# Altium project Drv8701e.PrjPcb
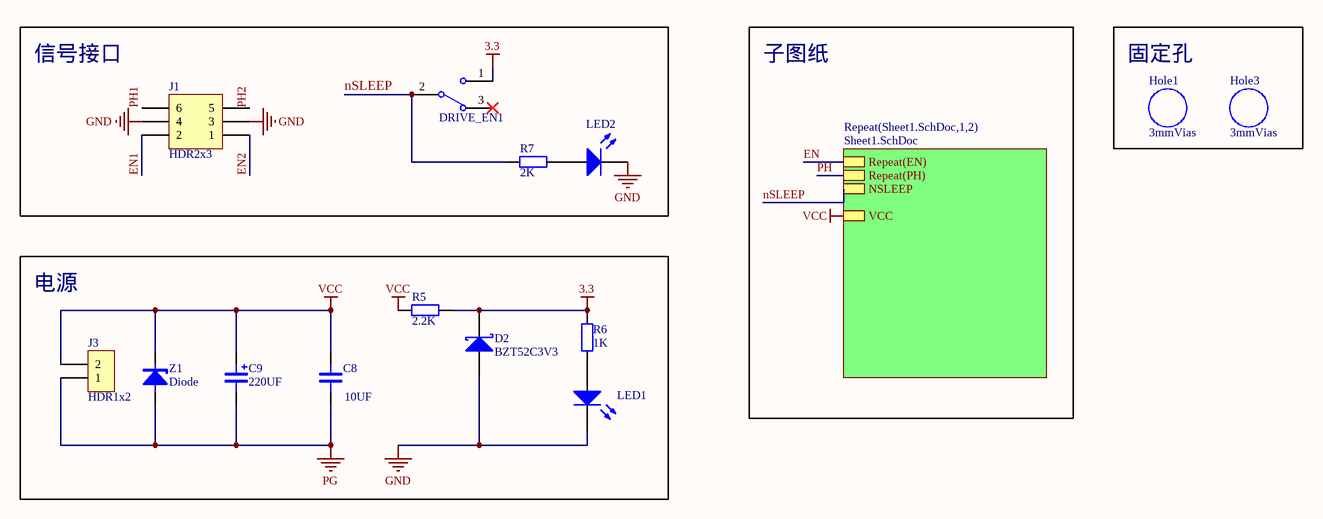
[diagram p0: Sheet2.SchDoc]
2 sheets, 46 parts. Net scope: hierarchical (ports join the sheet entries above them; power ports are global).
Board file: PCB1.PcbDoc
Sheets:
  Sheet2.SchDoc
    Sheet1.SchDoc1 = Sheet1.SchDoc
    Sheet1.SchDoc2 = Sheet1.SchDoc

## Sheet Sheet2.SchDoc
size A4

### Parts
C8  10UF  [0603]
C9  220UF  [DIP-EC3.5X8X11.5]
D2  BZT52C3V3  [SOD-123]
DRIVE_EN1  SW-SPDT  [ss12d10]  (value not drawn)
Hole1  3mmVias  [3mm]
Hole3  3mmVias  [3mm]
J1  HDR2x3  [pin_2*3]
J3  HDR1x2  [TX30_接口]
LED1  LED0  [0603-led]  (value not drawn)
LED2  LED0  [0603-led]  (value not drawn)
R5  2.2K  [0603]
R6  1K  [0603]
R7  2K  [0603]
Z1  Diode  [SMA]

### Blocks framed on the sheet
信号接口: DRIVE_EN1 J1 LED2 R7
固定孔: Hole1 Hole3
电源: C8 C9 D2 J3 LED1 R5 R6 Z1

### Sub-sheets
Repeat(Sheet1.SchDoc,1,2) = Sheet1.SchDoc: Repeat(EN), Repeat(PH), NSLEEP, VCC

### Nets
3.3: D2.1(K) DRIVE_EN1.1 R5.1 R6.1
GND: D2.3(A) J1.3 J1.4 LED1.2(K) LED2.2(K)
PG: C8.1 C9.2 J3.1 Z1.1(A)
VCC: C8.2 C9.1 J3.2 R5.2 Z1.2(C) ; sheet Repeat(Sheet1.SchDoc,1,2)/VCC
EN: sheet Repeat(Sheet1.SchDoc,1,2)/Repeat(EN)
EN1: J1.2
EN2: J1.1
nSLEEP: DRIVE_EN1.2 R7.2 ; sheet Repeat(Sheet1.SchDoc,1,2)/NSLEEP
PH: sheet Repeat(Sheet1.SchDoc,1,2)/Repeat(PH)
PH1: J1.6
PH2: J1.5
NetLED1_1: LED1.1(A) R6.2
NetLED2_1: LED2.1(A) R7.1

Not connected (* = marked no-connect by the designer): DRIVE_EN1 3*

### Notes on the sheet
- 子图纸

### Library data of the parts
C8 = CAP: Capacitor
C9 = CAP-TANTALUM: Tantalum Capacitor
D2 = Diode 18TQ045: Schottky Rectifier; Note: Terminal 2 is the TAB and is electrically connected to the cathode; Published: 8-Jun-2000; LatestRevisionDate: 17-Jul-2002; LatestRevisionNote: Re-released for DXP Platform.; DatasheetVersion: Dec-1997; PackageVersion: Feb-1998; PackageReference: TO-220AC; Publisher: Altium Limited; PackageDescription: TO, Thru-Hole, Vertical, Heatsink Mounted; 3 In-Line Leads (1 Absent); Pitch 2.54 mm; ComponentLink1Description: Manufacturer Link; ComponentLink1URL: http://www.irf.com/; ComponentLink2Description: Datasheet; ComponentLink2URL: http://www.irf.com/product-info/datasheets/data/18tq.pdf
DRIVE_EN1 = SW-SPDT: SPDT Subminiature Toggle Switch, Right Angle Mounting, Vertical Actuation; Published: 24-Mar-1999; LatestRevisionDate: 17-Dec-2003; LatestRevisionNote: Schematic revised, PCB Footprint replaced.; DatasheetVersion: 05-Dec-2000; PackageReference: TL36WW15050; Publisher: Altium Limited; PackageDescription: Switch; 4 Leads; ComponentLink1Description: Manufacturer Link; ComponentLink1URL: http://www.apem.com
J1 = HDR2x3: Connector
J3 = HDR1x2: Connector
LED1 LED2 = LED0: Typical INFRARED GaAs LED; Published: 8-Jun-2000; LatestRevisionDate: 08-Jul-2005; LatestRevisionNote: Mech Layer 1 removed.; PackageReference: LED-0; Publisher: Altium Limited; PackageDescription: LED; 2 Leads
R5-R7 = RES: Resistor
Z1 = Diode: Zener Diode

## Sheet Sheet1.SchDoc
size A4 portrait
Used 2 times, as channels Sheet1.SchDoc1, Sheet1.SchDoc2. Parts and nets are listed once, with the designators drawn on the sheet.
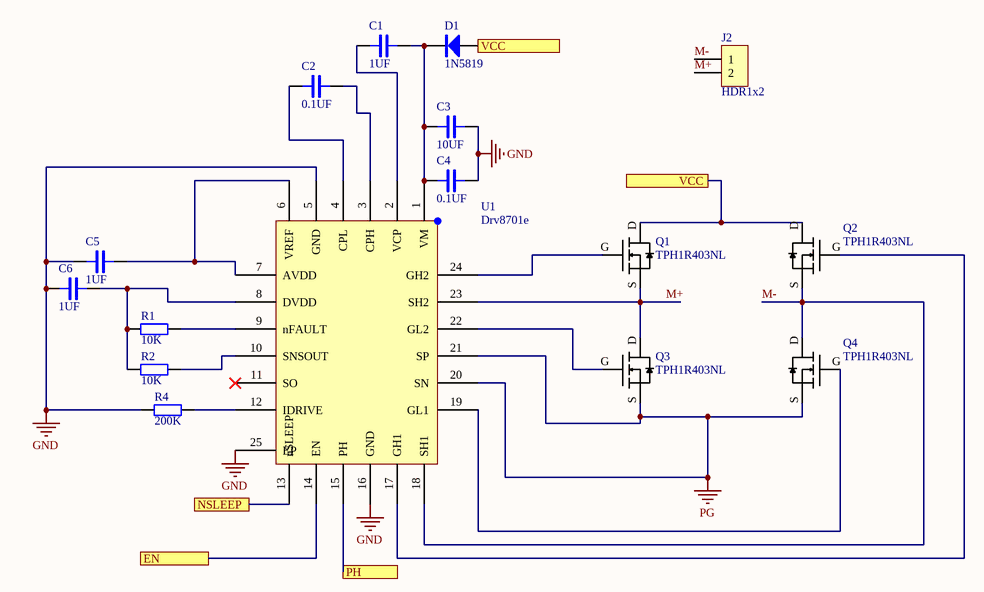
[diagram p1: Sheet1.SchDoc]

### Parts
C1  1UF  [0603]
C2  0.1UF  [0603]
C3  10UF  [0603]
C4  0.1UF  [0603]
C5  1UF  [0603]
C6  1UF  [0603]
D1  1N5819  [SOD-123]
J2  HDR1x2  [TX30_接口]
Q1  TPH1R403NL  [TPH1R403NL]
Q2  TPH1R403NL  [TPH1R403NL]
Q3  TPH1R403NL  [TPH1R403NL]
Q4  TPH1R403NL  [TPH1R403NL]
R1  10K  [0603]
R2  10K  [0603]
R4  200K  [0603]
U1  Drv8701e  [DRV8701E]

### Ports
EN, NSLEEP, PH, VCC

### Nets
GND: C3.2 C4.2 C5.1 C6.1 R4.2 U1.5(GND) U1.16(GND) U1.25(EP)
PG: Q3.S Q4.S U1.20(SN) U1.21(SP)
EN: U1.14(EN) ; port EN
M+: J2.2 Q1.S Q3.D U1.23(SH2)
M-: J2.1 Q2.S Q4.D U1.18(SH1)
NSLEEP: U1.13(nSLEEP) ; port NSLEEP
PH: U1.15(PH) ; port PH
VCC: D1.1(A) Q1.D Q2.D ; port VCC
NetC1_1: C1.1 U1.2(VCP)
NetC1_2: C1.2 C3.1 C4.1 D1.2(K) U1.1(VM)
NetC2_1: C2.1 U1.4(CPL)
NetC2_2: C2.2 U1.3(CPH)
NetC5_2: C5.2 U1.6(VREF) U1.7(AVDD)
NetC6_2: C6.2 R1.2 R2.2 U1.8(DVDD)
NetQ1_G: Q1.G(S) U1.24(GH2)
NetQ2_G: Q2.G(S) U1.17(GH1)
NetQ3_G: Q3.G(S) U1.22(GL2)
NetQ4_G: Q4.G(S) U1.19(GL1)
NetR1_1: R1.1 U1.9(nFAULT)
NetR2_1: R2.1 U1.10(SNSOUT)
NetR4_1: R4.1 U1.12(IDRIVE)

Not connected (* = marked no-connect by the designer): U1 11(SO)*

### Channels
Sheet1.SchDoc1: designators end in _Sheet1.SchDoc1; ports EN=EN1 NSLEEP=nSLEEP PH=PH1 VCC=VCC
Sheet1.SchDoc2: designators end in _Sheet1.SchDoc2; ports EN=EN2 NSLEEP=nSLEEP PH=PH2 VCC=VCC

### Notes on the sheet
- Title
- Size:
- Date:
- A4
- Number:
- Time:
- Revision:
- Sheet
- of
- File:

### Library data of the parts
C1-C6 = CAP: Capacitor
D1 = 1N4148: 高速开关二极管; 版权归属: 源创客; BOM名称: 高速开关二极管; 学习资源: www.ooocke.com
J2 = HDR1x2: Connector
R1 R2 R4 = RES: Resistor

## Nets that join several sheets
GND: Sheet2 (5 pins), Sheet1.SchDoc1 (8 pins), Sheet1.SchDoc2 (8 pins)
PG: Sheet2 (C8.1 C9.2 J3.1 Z1.1), Sheet1.SchDoc1 (Q3_Sheet1.SchDoc1.S Q4_Sheet1.SchDoc1.S U1_Sheet1.SchDoc1.20 U1_Sheet1.SchDoc1.21), Sheet1.SchDoc2 (Q3_Sheet1.SchDoc2.S Q4_Sheet1.SchDoc2.S U1_Sheet1.SchDoc2.20 U1_Sheet1.SchDoc2.21)
VCC: Sheet2 (5 pins), Sheet1.SchDoc1 (D1_Sheet1.SchDoc1.1 Q1_Sheet1.SchDoc1.D Q2_Sheet1.SchDoc1.D), Sheet1.SchDoc2 (D1_Sheet1.SchDoc2.1 Q1_Sheet1.SchDoc2.D Q2_Sheet1.SchDoc2.D)
EN1: Sheet2 (J1.2), Sheet1.SchDoc1 (U1_Sheet1.SchDoc1.14)
EN2: Sheet2 (J1.1), Sheet1.SchDoc2 (U1_Sheet1.SchDoc2.14)
nSLEEP: Sheet2 (DRIVE_EN1.2 R7.2), Sheet1.SchDoc1 (U1_Sheet1.SchDoc1.13), Sheet1.SchDoc2 (U1_Sheet1.SchDoc2.13)
PH1: Sheet2 (J1.6), Sheet1.SchDoc1 (U1_Sheet1.SchDoc1.15)
PH2: Sheet2 (J1.5), Sheet1.SchDoc2 (U1_Sheet1.SchDoc2.15)